# EAGLE design feederboard (EAGLE 6.4)
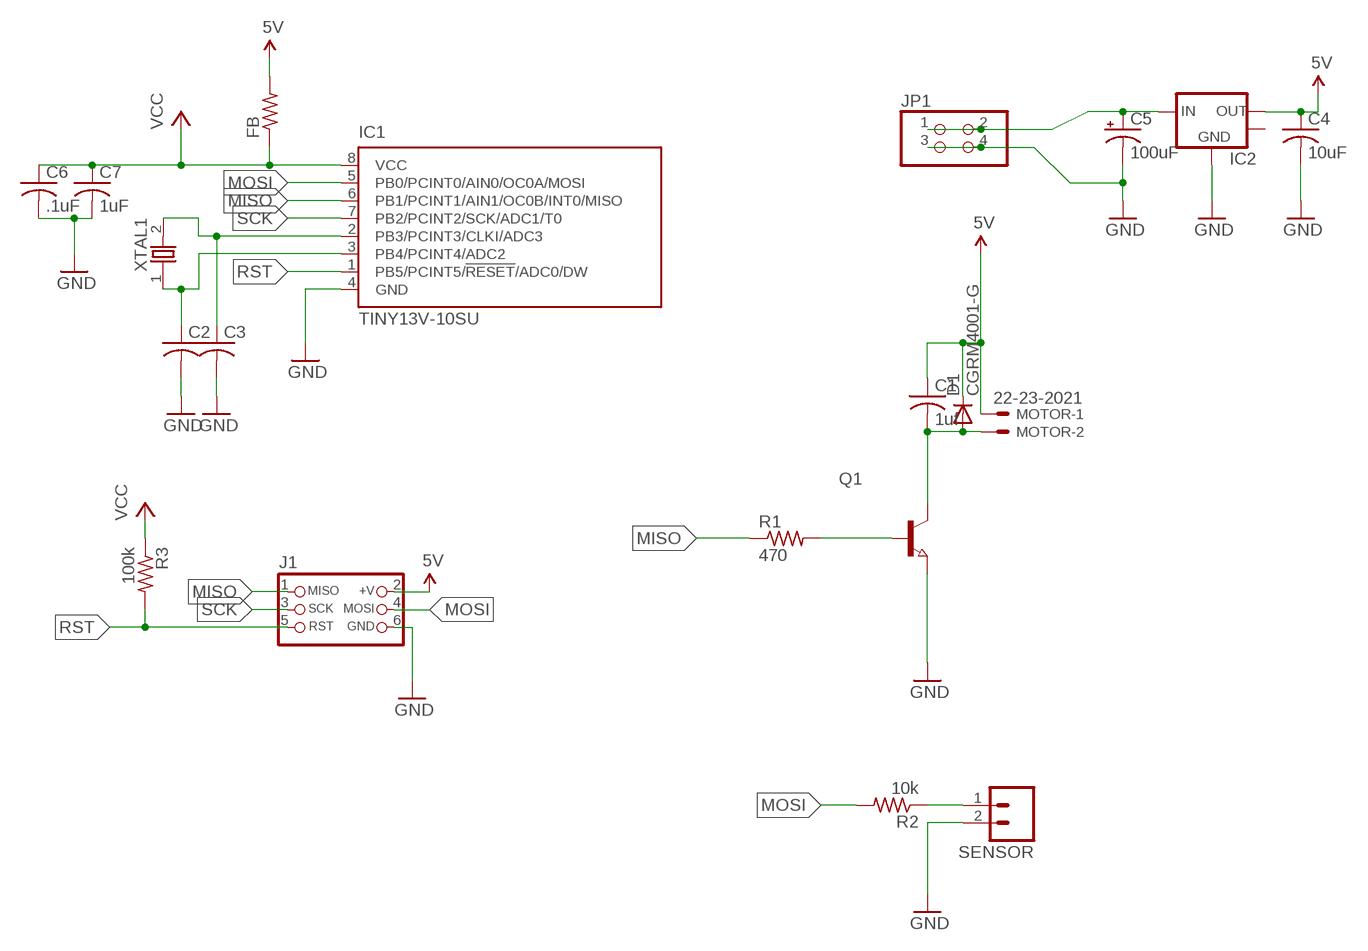
[diagram p0: schematic, sheet 1]

## Parts
C1  1uf  C-USC0805K  [C0805K]
C2  C-USC0805  [C0805]
C3  C-USC0805  [C0805]
C4  10uF  C-USC0805K  [C0805K]
C5  100uF  CPOL-USC  [PANASONIC_C]
C6  .1uF  C-USC0603  [C0603]
C7  1uF  C-USC0603  [C0603]
D1  CGRM4001-G  [SOD-123_MINI-SMA]
FB  R-US_R0805  [R0805]
IC1  TINY13V-10SU  [8S2]
IC2  V_REG_LM1117SOT223  [SOT223]
J1  CON_HEADER_PRG_AVR_ICSP_ETCH  [HEADER_PRG_2X03_ETCH]
JP1  PINHD-2X2/90  [2X02/90]
MOTOR  22-23-2021  [22-23-2021]
Q1  NPN-TRANSISTOR_SOT23  [SOT23]
R1  470  R-US_R0805  [R0805]
R2  10k  R-US_R0805  [R0805]
R3  100k  R-US_R0805  [R0805]
SENSOR  M02JST-PTH-2  [JST-2-PTH]
XTAL1  OSC-XTAL  [HC-49U-OR-DIP]

## Nets
5V: C1.1 C4.1 D1.C FB.2 IC2.2(VR-OUTSM) J1.2(+V) MOTOR.1
GND: C2.2 C3.2 C4.2 C5.- C6.2 C7.2 IC1.4(GND) IC2.1(GND) J1.6(GND) JP1.3 JP1.4 Q1.2(E) SENSOR.2
MISO: IC1.6(PB1/PCINT1/AIN1/OC0B/INT0/MISO) J1.1(MISO) R1.1
MOSI: IC1.5(PB0/PCINT0/AIN0/OC0A/MOSI) J1.4(MOSI) R2.2
N$2: C2.1 IC1.3(PB4/PCINT4/ADC2) XTAL1.1
N$3: C3.1 IC1.2(PB3/PCINT3/CLKI/ADC3) XTAL1.2
N$4: C1.2 D1.A MOTOR.2 Q1.3(C)
N$5: Q1.1(B) R1.2
RST: IC1.1(PB5/PCINT5/!RESET!/ADC0/DW) J1.5(RST) R3.2
SCK: IC1.7(PB2/PCINT2/SCK/ADC1/T0) J1.3(SCK)
SWITCH: R2.1 SENSOR.1
VCC: C6.1 C7.1 FB.1 IC1.8(VCC) R3.1
VIN: C5.+ IC2.3(IN) JP1.1 JP1.2
Unconnected: IC2.4(OUT)

## Library data of the parts
C1-C4 C6 C7 = LL:C-US: CAPACITOR, American symbol
C5 = LL:CPOL-US: POLARIZED CAPACITOR, American symbol Footprints somewhat modified from Adafruits (1206)
D1 = diode:CGRM400*-G: Molded plasitc,JEDEC SOD-123/Mini SMA Source: Comchip CGRM4001-G.pdf
FB R1-R3 = LL:R-US_: RESISTOR, American symbol
IC1 = atmel:TINY13: 8-bit AVR Microcontroller with 1K Bytes In-System Programmable Flash Source: http://www.atmel.com/dyn/resources/prod_documents/2535S.pdf; MPN: ATTINY13V-10SU; OC_FARNELL: 9171584; OC_NEWARK: 96K6524
IC2 = LL:V_REG_LM1117: Voltage Regulator LM1117 Standard adjustable voltage regulator but in SMD form. Fixed voltage type.
J1 = LL:CON_HEADER_PRG_AVR_ICSP_ETCH: 2x3 AVR ICSP programming header for etching
JP1 = pinhead:PINHD-2X2: PIN HEADER
MOTOR = con-molex:22-23-2021: .100" (2.54mm) Center Header - 2 Pin; MF: MOLEX; MPN: 22-23-2021; OC_FARNELL: 1462926; OC_NEWARK: 25C3832
Q1 = semicon-smd-ipc:NPN-TRANSISTOR_: NPN TRANSISTOR
SENSOR = SparkFun-Connectors:M02: Header 2 Standard 2-pin 0.1" header. Use with straight break away headers (SKU : PRT-00116), right angle break away headers (PRT-00553), swiss pins (PRT-00743), machine pins (PRT-00117), and female headers (PRT-00115). Molex polarized connector foot print use with SKU : PRT-08233 with associated crimp pins and housings.
XTAL1 = LL:OSC-XTAL: HC49U crystal with Thru Hole Option

## Board
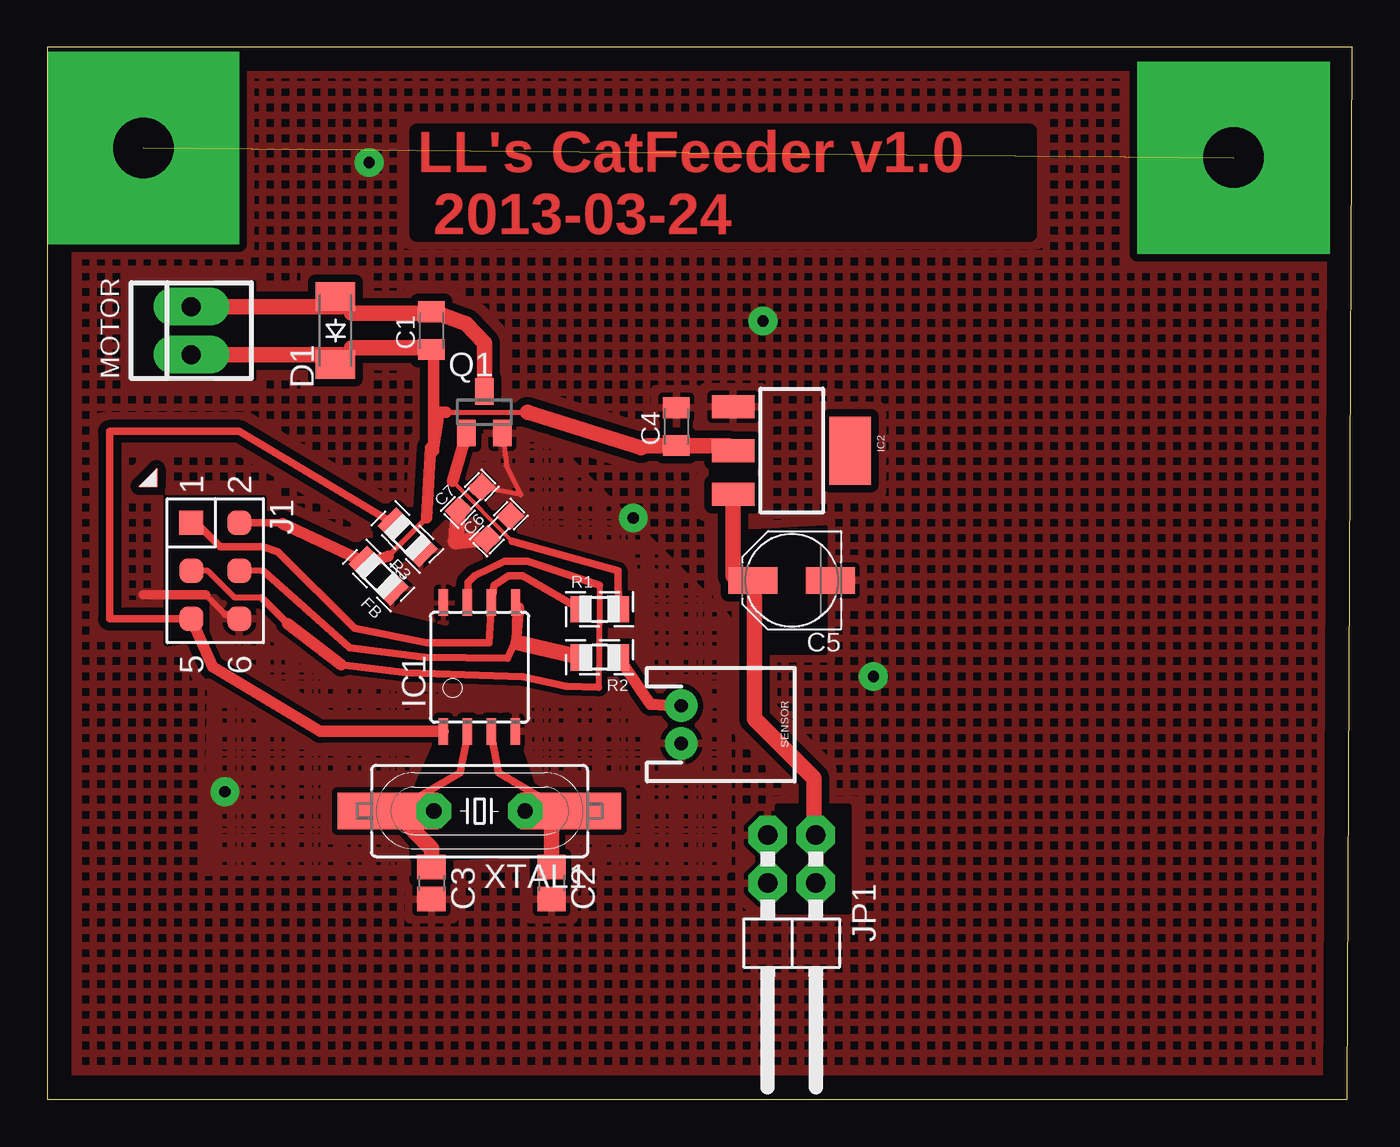
[diagram p1: board, top side]

Size 69.01 x 55.62 mm. Coordinates in mm from the lower left corner, seen from the top.
Outline: 0,0 68.76,0 69.01,55.62 0,55.62 0,0
Copper layers (1*16): Top 0.0356mm / dielectric 1.5011mm / Bottom 0.0356mm
Design rules "ll-etch-lax *": minimum track width 8mil, minimum drill 21mil, track to track 8mil, track to pad 7mil, pad to pad 12mil, via to via 20mil, smd to smd 4mil, copper to edge 50mil, drill to drill 30mil, minimum pad ring 20mil, minimum via ring 18mil, stop-mask expansion 0mil, vias tented up to drill 20mil, thermal gap 10mil

### Footprints (pad centres in the part's own frame; a part is rotated, then mirrored left to right if it is on the bottom)
C0805K = smd 1.1 x 1.4: 1 -1,0; 2 1,0
C0805 = smd 1.3 x 1.5: 1 -0.85,0; 2 0.85,0
PANASONIC_C = smd 2.6 x 1.4: + 2.05,0; - -2.05,0
C0603 = smd 1.1 x 1: 1 -0.85,0; 2 0.85,0
SOD-123_MINI-SMA = smd 1.5 x 2.1: A 1.8,0; C -1.8,0
R0805 = smd 1.1 x 1.4: 1 -1,0; 2 1,0
8S2 = smd 0.5 x 1.4: 1 -1.905,-3.404; 2 -0.645,-3.404; 3 0.625,-3.404; 4 1.895,-3.404; 5 1.905,3.404; 6 0.635,3.404; 7 -0.635,3.404; 8 -1.905,3.404
SOT223 = smd 1.219 x 2.235: 1 -2.311,-3.099; 2 0,-3.099; 3 2.311,-3.099 | smd 3.6 x 2.2: 4 0,3.099
HEADER_PRG_2X03_ETCH = smd 1.27 x 1.27: 1 -2.54,-1.27; 2 -2.54,1.27; 3 0,-1.27; 4 0,1.27; 5 2.54,-1.27; 6 2.54,1.27
2X02/90 = drill 1.016 octagon: 1 -1.27,-6.35; 2 -1.27,-3.81; 3 1.27,-6.35; 4 1.27,-3.81
22-23-2021 = drill 1 long: 1 -1.27,0; 2 1.27,0
SOT23 = smd 1 x 1.4: 1 -0.95,-1.1; 2 0.95,-1.1; 3 0,1.1
JST-2-PTH = drill 0.7 pad 1.448: 1 -1,0; 2 1,0
HC-49U-OR-DIP = smd 5.334 x 1.93: 1 -4.826,0; 2 4.826,0 | drill 0.8 octagon: P$1 -2.413,0; P$2 2.413,0

### Placement (x,y rotation side)
C1  20.32,40.64 90 top
C2  26.67,11.43 270 top
C3  20.32,11.43 270 top
C4  33.27,35.56 90 top
C5  39.37,27.43 180 top
C6  23.88,30.23 45 top
C7  22.35,31.75 45 top
D1  15.24,40.64 90 top
FB  17.53,27.69 135 top
IC1  22.86,22.86 0 top
IC2  39.37,34.29 270 top
J1  8.89,27.94 270 top
JP1  39.37,7.62 180 top
MOTOR  7.62,40.64 90 top
Q1  23.11,36.32 0 top
R1  29.21,25.91 0 top
R2  29.21,23.37 180 top
R3  19.05,29.72 135 top
SENSOR  33.53,19.81 270 top
XTAL1  22.86,15.24 180 top

### Tracks (layer width: path | path; a pad name or v marks a point on that pad's centre or on a via)
5V
  Top 0.254: 21.08,36.32 25.4,36.32 | 18.03,28.7 20.07,30.73
  Top 0.305: 16.1,39.73 15.24,38.86 D1.C 15.54,39.37 | 20.32,39.73 C1.1 20.42,39.62 | IC2.2 36.02,34.54 | 31.75,34.54 C4.1 31.39,34.44 | 12.45,30.43 12.24,30.48 | 20.52,34.44 20.27,34.44 20.42,34.29
  Top 0.406: 12.24,30.48 J1.2 | 20.52,34.44 20.83,36.32
  Top 0.61: 12.45,30.43 FB.2 16.61,28.25 18.03,28.7 | 20.83,36.32 21.08,36.32 | 20.07,30.73 20.27,34.44 | 20.42,34.29 20.42,39.62
  Top 0.813: 16.1,39.73 20.32,39.73 | 36.02,34.54 31.75,34.54 | 25.4,36.32 31.39,34.44 | 15.54,39.37 MOTOR.1
GND  (via drill 0.6)
  Top 0.254: C7.2 25.04,31.95 24.28,33.48 24.08,35.2 Q1.2
  Top 0.305: 9.4,25.65 8.38,26.67
  Top 0.406: J1.6 9.4,25.65
  Top 0.508: 8.38,26.67 5.08,26.67
  other vias: 9.4,16.26 17.02,49.53 30.99,30.73 37.85,41.15 43.69,22.35
  pour Top (isolate 0.406, rank 3, hatched): 0,55.37 68.58,55.63 69.09,-1.02 0,0
  pour Top (isolate 0.305, rank 2, hatched): 8.64,26.16 8.38,11.94 35.81,11.94 36.07,12.19 36.07,25.4 26.42,35.05 20.83,35.05 12.45,26.67
MISO
  Top 0.406: J1.1 7.87,30.48 9.14,29.21 11.43,29.21 12.19,28.96 16.26,24.89 20.07,24.13 23.37,24.13 IC1.6 23.62,27.18 24.38,27.69 25.15,27.69 R1.1
MOSI
  Top 0.305: 24.89,24.13 25.04,26.06 IC1.5 24.74,26.11 24.74,25.91 24.69,24.08 | 11.43,27.94 J1.4
  Top 0.406: 11.43,27.94 16,23.88 19.96,23.37 24.33,23.32 24.69,24.08
  Top 0.813: 24.89,24.13 R2.2
N$1
  cutout Top: 6.35,31.75 11.43,31.75 11.43,26.92 8.38,26.92 8.38,24.38 6.35,24.13
N$2
  Top 0.305: 23.52,19.05 23.52,19.41 IC1.3 | 27.33,15.24 XTAL1.1 26.67,15.7
  Top 0.406: 27.33,15.24 23.88,17.27 23.52,19.05
  Top 0.813: 26.67,15.7 C2.1
N$3
  Top 0.305: 22.2,19.1 22.2,19.41 IC1.2 | 18.34,15.24 XTAL1.2 18.44,15.14
  Top 0.406: 18.34,15.24 21.84,17.27 22.2,19.1
  Top 0.813: C3.1 20.32,13.26 18.44,15.14
N$4
  Top 0.305: 16.1,41.55 15.24,42.42 D1.A 15.54,41.91 | 20.32,41.55 C1.2 20.93,41.45
  Top 0.813: 16.1,41.55 20.32,41.55 | 20.93,41.45 22.15,41 23.11,39.98 Q1.3 | 15.54,41.91 MOTOR.2
N$5
  Top 0.203: 21.44,32.66 24.59,29.52
  Top 0.406: 24.59,29.52 30.18,27.94 R1.2
  Top 0.61: 21.44,32.66 Q1.1
N$6
  cutout Top: 21.08,20.07 19.05,15.49 19.3,12.7 26.92,12.95 24.38,20.32
N$7
  cutout Top: 36.83,29.97 37.85,23.62 41.15,23.62 41.15,30.23
N$8
  cutout Top: 4.57,43.18 10.92,43.18 10.92,38.1 4.57,38.1
N$9
  cutout Top: 38.61,15.49 38.61,9.91 42.42,9.91 42.42,15.49
N$10  (via drill 3.2 pad 10.16)  (1 unrouted)
  other vias: 5.08,50.29 62.74,49.78
RST
  Top 0.305: 20.93,19.46 IC1.1
  Top 0.406: R3.2 10.16,35.31 3.3,35.31 3.3,25.4 J1.5
  Top 0.61: J1.5 8.74,22.86 14.43,19.46 20.93,19.46
SCK
  Top 0.305: J1.3 8.48,27.94 9.91,26.52 11.33,26.52 | 29.16,21.79 29.21,26.16 29.21,27.18 | 22.25,26.31 IC1.7
  Top 0.406: 12.7,25.15 11.33,26.52 | 15.54,22.96 19,22.55 25.15,22.35 27.43,21.84 29.16,21.79 | 29.21,27.18 25.4,28.45 24.18,28.45 22.61,27.69 22.25,27.33 22.25,26.31
  Top 0.61: 15.54,22.96 12.7,25.15
SWITCH
  Top 0.61: R2.1 31.39,21.59 31.9,20.88 32.72,20.83 SENSOR.1
VCC
  Top 0.305: 20.98,26.31 IC1.8
  Top 0.813: C7.1 21.59,29.46 C6.1
  pour Top (isolate 0.406): 17.02,26.16 19.05,28.45 21.84,31.24 24.13,29.21 21.08,25.15
VIN
  Top 0.305: 37.29,26.67 C5.+ 37.39,26.57 | 40.54,14.07 JP1.1
  Top 0.406: 37.29,26.67 36.27,27.69
  Top 0.813: 36.27,27.69 IC2.3 | JP1.1 JP1.2 | 37.39,26.57 37.39,20.12 40.54,16.97 40.54,14.07

### Text on the board
Top: LL's CatFeeder v1.0 / 2013-03-24